# Altium schematic sheet Block_diagram.SchDoc: Block diagram
size A3; DrawnBy: Sara V. Martínez; Engineer: Flight; DocumentNumber: 1; Revision: V0.1; SheetNumber: 1; SheetTotal: 11
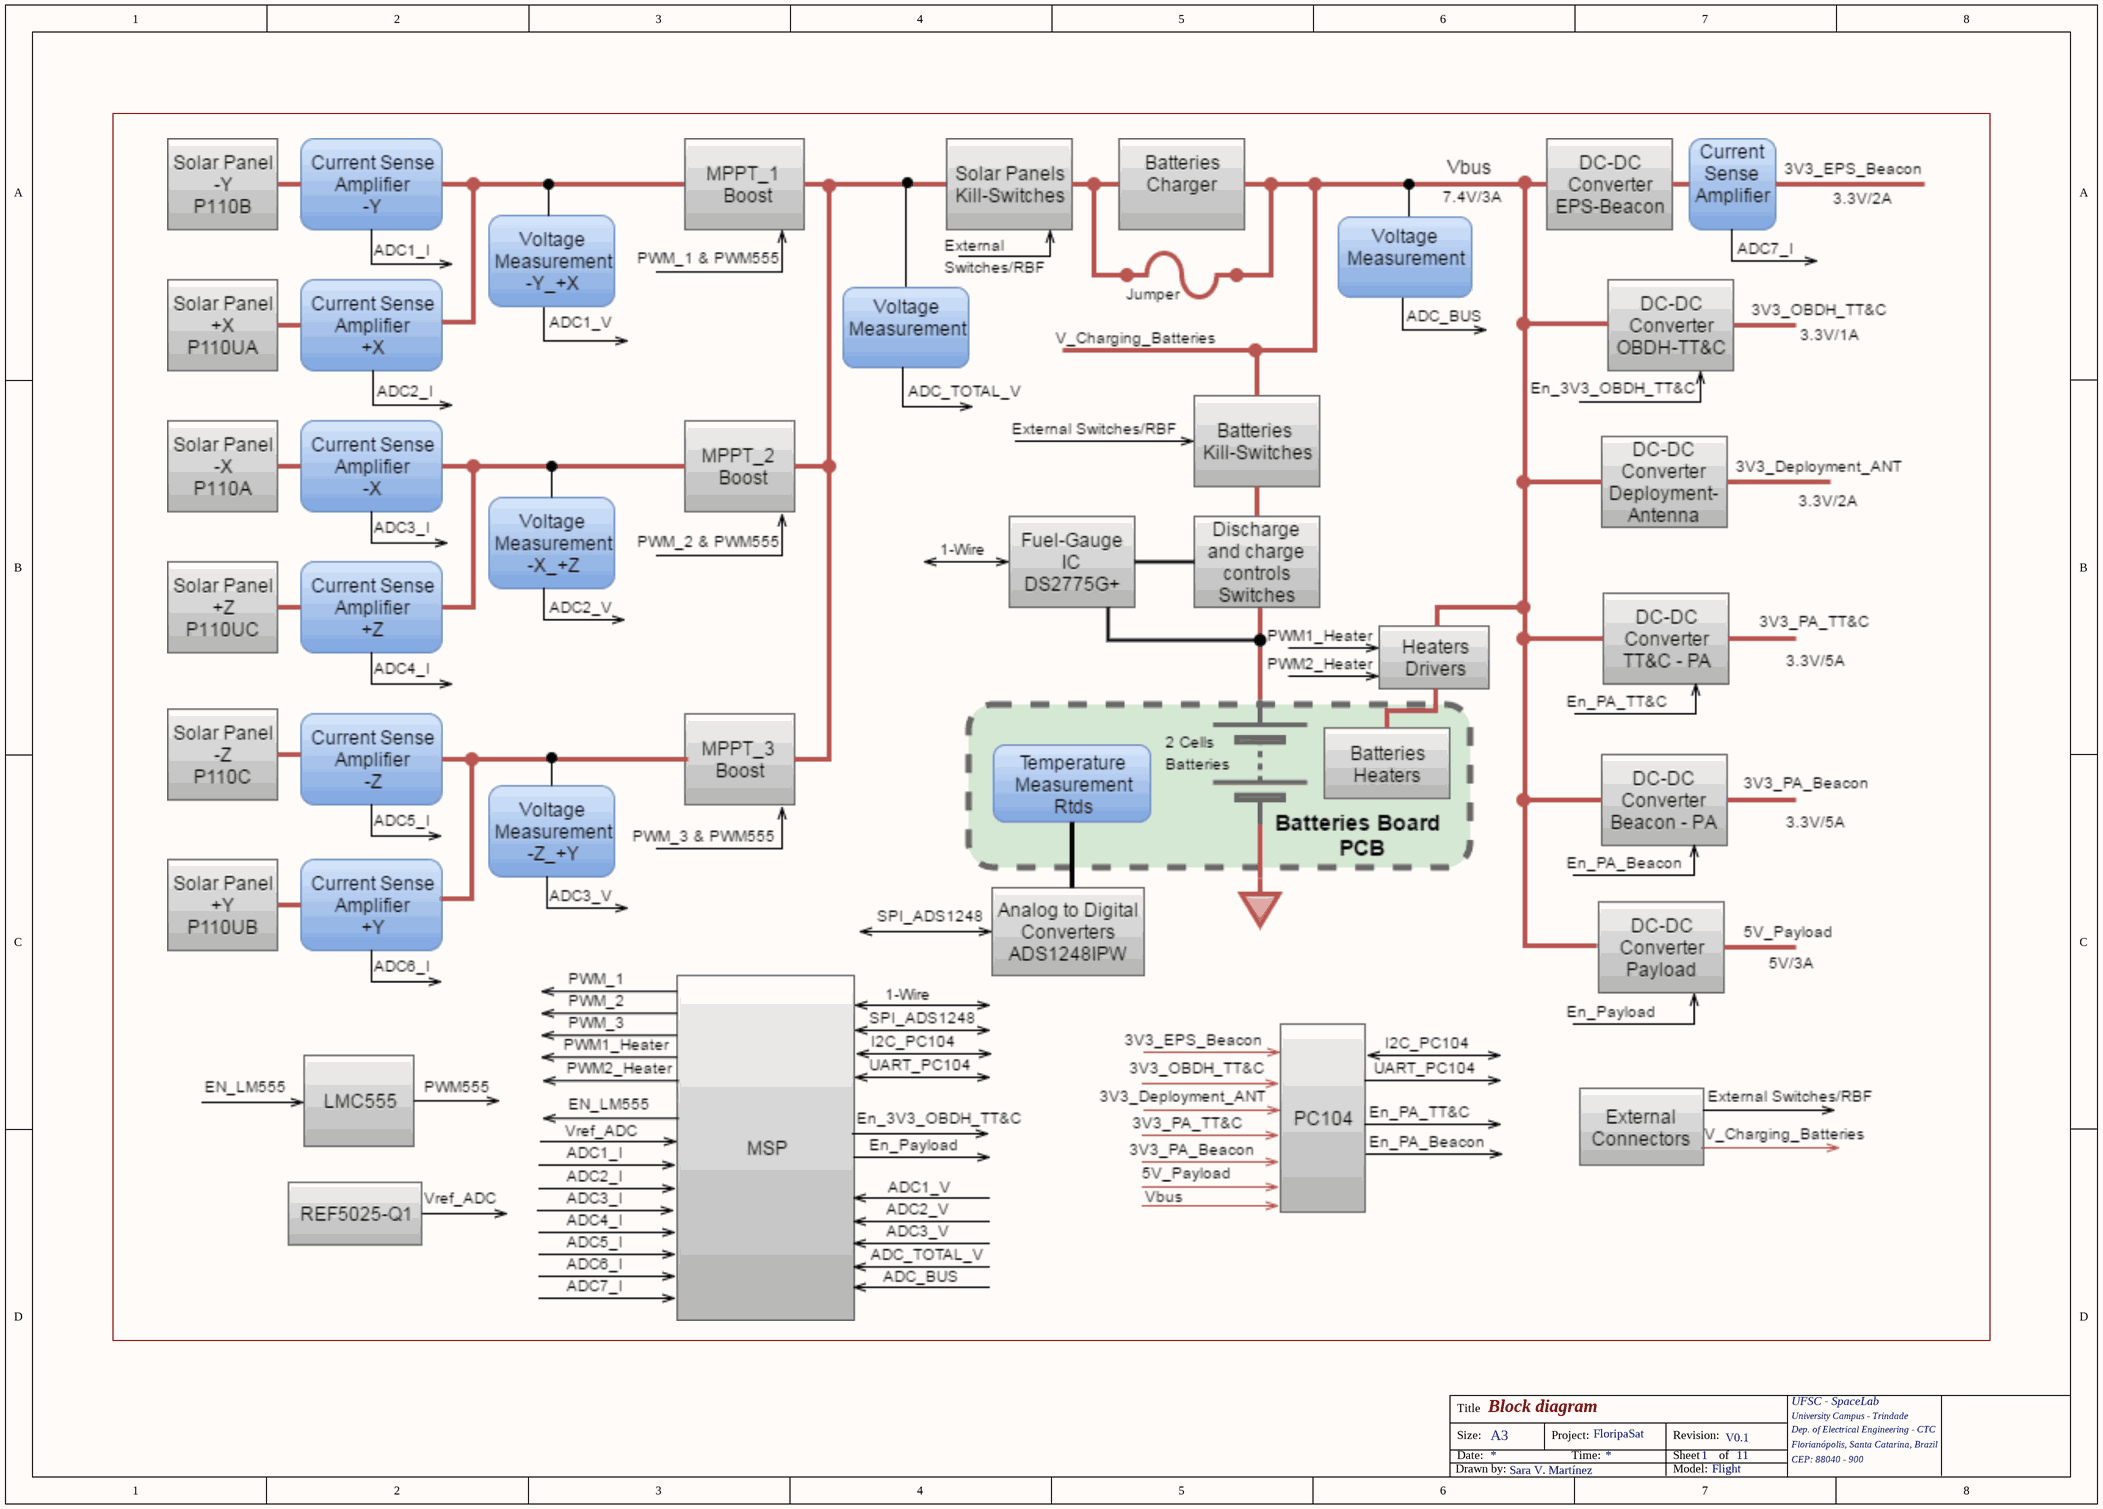
[diagram p0: Block_diagram.SchDoc]

## Sub-sheets
PCB = EPS_Interface.SchDoc: no entries

## Notes on the sheet
- Title
- Size:
- Date:
- A3
- Project:
- Time:
- FloripaSat
- Revision:
- Sheet
- of
- UFSC - SpaceLab
- University Campus - Trindade
- Dep. of Electrical Engineering - CTC
- Florianópolis, Santa Catarina, Brazil
- CEP: 88040 - 900
- Drawn by:
- Model: